# EasyEDA Pro project hydroNodeStation01PCB.epro

# Board PCB2
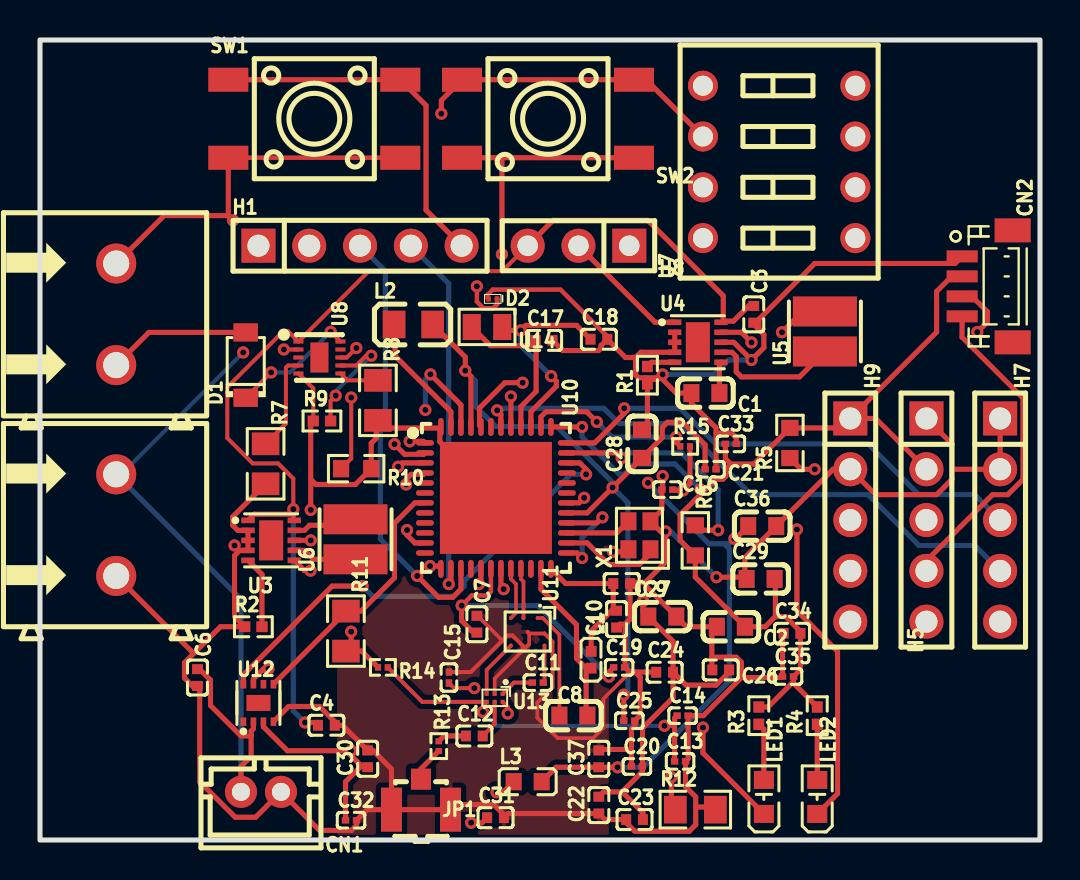
[diagram p0: board, top side]
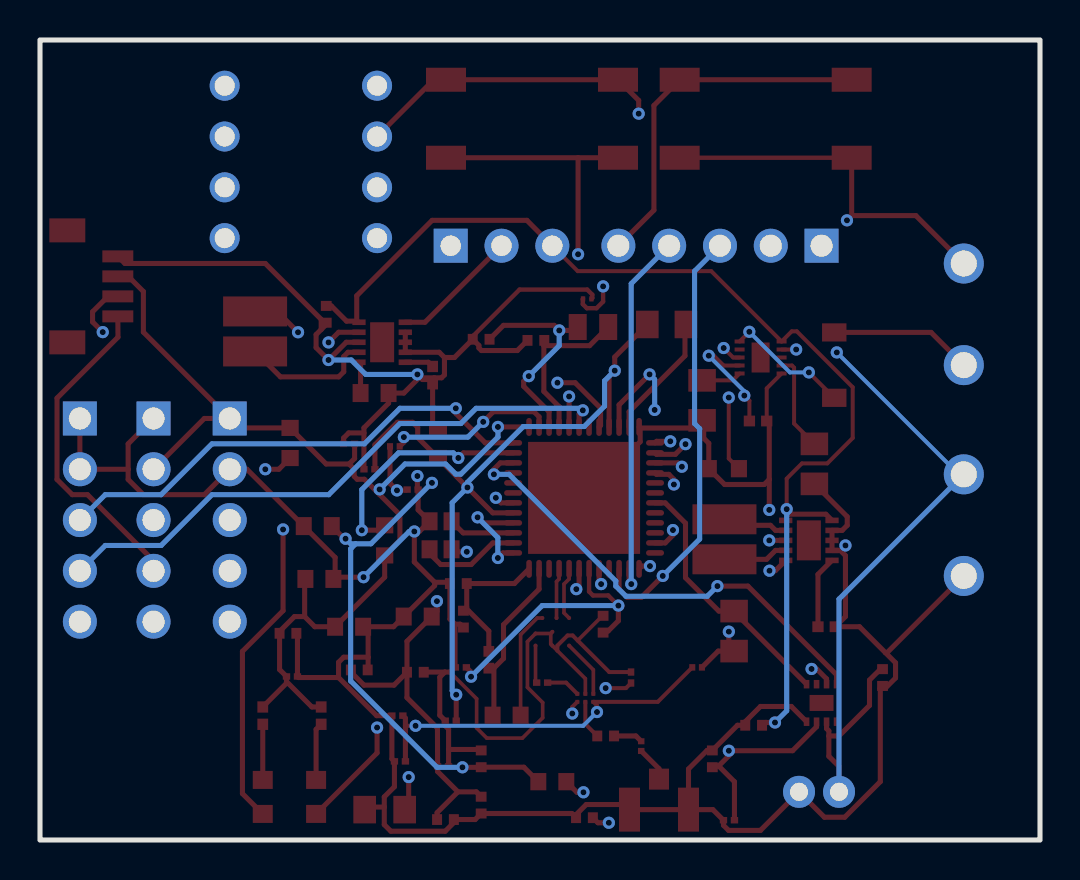
[diagram p1: board, bottom side, seen from below]

Outline 50 x 40 mm; copper layers: Top Layer, Inner1, Inner2, Bottom Layer. Coordinates in mm from the lower left corner of the outline.
Outline path: rectangle 0,40 50,0
Stack: Top Layer 0.035mm Outer layer thickness 1oz / Dielectric1 0.2104mm 7628 RC49% 8.6mil / Inner1 0.0152mm Inner layer thickness / Dielectric2 1.065mm 1.1mm H/HOZ Copper / Inner2 0.0152mm Inner layer thickness / Dielectric3 0.2104mm 7628 RC49% 8.6mil / Bottom Layer 0.035mm Outer layer thickness 1oz

## Design rules (mm)
template: JLCPCB Capability(Two Layers Board)
spacing copperThickness1oz (default): track to track 0.102, other pairs 0.152 to 0.3
spacing copperThickness2oz: track to track 0.203, other pairs 0.152 to 0.3
track width copperThickness1oz (default): min 0.127, default 0.254, max 2.54
track width copperThickness2oz: min 0.203, default 0.254, max 2.54
differential pair differentialPair (default): width min 0.127, default 0.254, max 2.54; gap min 0.152, default 0.152
via viaSize (default): diameter min 0.5, default 0.61, max 10; hole min 0.3, default 0.305, max 6.3

## Placement (name value [footprint] x y rotation side)
C1  22uF  [C0603]  33.27 22.35 180 top
C2  22uF  [C0603]  34.54 10.66 180 top
C3  10uF  [C0402]  35.69 26.28 270 top
C4  10uF  [C0402]  14.32 5.74 0 top
C6  100nF  [C0402]  7.87 8.12 270 top
C7  100nF  [C0402]  21.84 10.79 270 top
C8  100pF  [C0603]  26.67 6.22 0 top
C9  68pF  [C0402]  29.08 12.82 180 top
C10  47nF  [C0402]  28.83 11.04 90 top
C11  68pF  [C0201]  24.89 7.87 0 top
C12  68pF  [C0402]  21.72 5.2 0 top
C13  100nF  [C0201]  32 3.93 0 top
C14  1nF  [C0201]  32.13 6.22 0 top
C15  100nF  [C0201]  20.45 8.12 270 top
C16  1nF  [C0201]  31.37 17.52 0 top
C17  6.8pF  [C0402]  25.21 24.98 0 top
C18  6.8pF  [C0402]  27.94 25.04 0 top
C19  100nF  [C0201]  28.96 8.63 0 top
C20  33pF  [C0201]  29.84 3.68 0 top
C21  33pF  [C0201]  33.53 18.54 180 top
C22  100nF  [C0402]  27.94 1.74 90 top
C23  100nF  [C0402]  29.73 1.02 0 top
C24  100nF  [C0402]  31.23 8.39 0 top
C25  33pF  [C0201]  29.46 5.96 0 top
C26  100nF  [C0402]  34.04 8.5 180 top
C27  4.7uF  [C0603]  31.12 11.17 0 top
C28  470nF  [C0603]  30.1 19.81 90 top
C29  4.7uF  [C0603]  36.03 13.05 0 top
C30  100nF  [C0402]  16.38 4.06 90 top
C31  100nF  [C0402]  22.78 1.12 0 top
C32  100nF  [C0201]  15.55 0.99 0 top
C33  100nF  [C0201]  34.54 19.81 0 top
C34  100nF  [C0402]  37.6 10.33 0 top
C35  100nF  [C0201]  37.4 8.18 0 top
C36  4.7uF  [C0603]  36.11 15.69 0 top
C37  100nF  [C0402]  27.94 4.06 90 top
CN1  B2B-PH-K-S(LF)(SN)  [CONN-TH_B2B-PH-K-S]  11.05 2.41 180 top
CN2  BM04B-SRSS-TB(LF)(SN)  [CONN-SMD_BM04B-SRSS-TB]  47.37 27.68 270 top
D1  MBRX120LF-TP  [SOD-123_L2.7-W1.6-LS3.7-RD]  10.29 23.74 90 top
D2  ESDALC6V1-1U2  [DFN0603-D_L0.6-W0.3-P0.34-RD]  22.64 27.06 180 top
H1  PZ254V-11-05P  [HDR-TH_5P-P2.54-V-M]  16 29.71 0 top
H5  PZ254V-11-05P  [HDR-TH_5P-P2.54-V-M]  44.32 16 270 top
H7  PZ254V-11-05P  [HDR-TH_5P-P2.54-V-M]  48.01 16 270 top
H8  PZ254V-11-03P  [HDR-TH_3P-P2.54-V-M_PZ254V-11-03P]  26.92 29.71 180 top
H9  PZ254V-11-05P  [HDR-TH_5P-P2.54-V-M]  40.51 16 270 top
JP1  6GHz  [RF-SMD_FRF05002-JSS103M]  19.05 2.28 180 top
L1  47nH  [L0402]  27.56 9.01 270 top
L2  15uH  [L0805]  18.67 25.78 0 top
L3  FCM1608KF-601T03  [L0603]  24.38 2.92 0 top
LED1  YLED0603R  [LED0603-FD]  36.19 2.15 270 top
LED2  YLED0603R  [LED0603-FD]  38.86 2.15 270 top
P1  WJ500V-5.08-2P  [CONN-TH_2P-P5.00_WJ500V-5.08-2P]  3.81 26.28 90 top
P2  WJ500V-5.08-2P  [CONN-TH_2P-P5.00_WJ500V-5.08-2P]  3.81 15.74 90 top
R1  36.5kΩ  [R0402]  30.37 23.24 90 top
R2  16.2kΩ  [R0402]  10.67 10.66 0 top
R3  1kΩ  [R0402]  35.94 6.22 90 top
R4  1kΩ  [R0402]  38.86 6.22 90 top
R5  4.7kΩ  [R0603]  37.5 19.85 90 top
R6  4.7kΩ  [R0603]  32.77 14.98 270 top
R7  10kΩ  [R0805]  11.28 18.81 270 top
R8  10kΩ  [R0805]  16.9 21.98 270 top
R9  12kΩ  [R0402]  14.1 20.95 0 top
R10  300Ω  [R0603]  15.81 18.57 180 top
R11  10kΩ  [R0805]  15.29 10.45 270 top
R12  10kΩ  [R0805]  32.77 1.52 0 top
R13  0Ω  [R0201]  19.94 4.69 270 top
R14  100Ω  [R0201]  17.15 8.63 180 top
R15  100Ω  [R0201]  32.26 19.68 0 top
SW1  TS-1095PS-A1B2-C3D2  [KEY-SMD_4P-L6.0-W6.0-P3.90-LS9.0]  13.72 36.06 0 top
SW2  TS-1095PS-A1B2-C3D2  [KEY-SMD_4P-L6.0-W6.0-P3.90-LS9.0]  25.4 36.06 180 top
U3  TPS63900DSKR  [WSON-10_L2.5-W2.5-W0.50-TL-EP]  11.56 14.98 0 top
U4  TPS63900DSKR  [WSON-10_L2.5-W2.5-W0.50-TL-EP]  32.89 24.89 0 top
U5  2.2uH  [IND-SMD_L3.0-W3.0_LVF303012-4R7M-N]  39.25 25.43 90 top
U6  2.2uH  [IND-SMD_L3.0-W3.0_LVF303012-4R7M-N]  15.78 15.03 90 top
U7  SMQS-04R-TP  [SW-TH_8P-P2.54_SMQS-04R-TP]  36.96 33.9 90 top
U8  BQ25185DLHR  [WSON-10_L2.2-W2.0-P0.40-BL-EP_TI_DLH0010A]  13.97 24.12 270 top
U10  STM32WLE5CCU6  [UFQFPN-48_L7.0-W7.0-P0.50-BL-EP5.6]  22.8 17.1 270 top
U11  BALFHB-WL-02D3  [CSPG-8_L2.1-W1.8_BALFHB-WL-03D3]  24.38 10.41 270 top
U12  MAX17048G+T10  [TDFN-8_L2.0-W2.0-P0.50-BL-EP1.2]  10.92 6.85 0 top
U13  BGS12SN6E6327XTSA1  [TSNP-6_L1.1-W0.7-P0.40-BL]  22.73 7.11 180 top
U14  32.768kHz  [CRYSTAL-SMD_L2.0-W1.2]  22.35 25.65 180 top
X1  32MHz  [CRYSTAL-SMD_4P-L2.0-W1.6-BL]  29.97 15.23 90 top

## Footprints (pads in the part's own frame, mm; a bottom-side part is the same pattern mirrored in y, then rotated)
C0201
  rect 0.368x0.324 smd: 1(-0.275,0) 2(0.275,0)
C0402
  rect 0.5x0.54 smd: 1(-0.42,0) 2(0.42,0)
C0603
  rect 0.8x0.9 smd: 1(-0.7,0) 2(0.7,0)
CONN-SMD_BM04B-SRSS-TB
  rect 1.2x1.8 smd: 0(-2.8,1.262) 0(2.8,1.262)
  rect 0.6x1.55 smd: 1(-1.5,-1.262) 2(-0.5,-1.262) 3(0.5,-1.262) 4(1.5,-1.262)
CONN-TH_2P-P5.00_WJ500V-5.08-2P
  round 2 hole 1.3: 1(-2.54,0) 2(2.54,0)
CONN-TH_B2B-PH-K-S
  round 1.6 hole 0.9: 1(1,0) 2(-1,0)
CRYSTAL-SMD_4P-L2.0-W1.6-BL
  rect 0.9x0.8 smd: 1(-0.7,-0.55) 2(0.7,-0.55) 3(0.7,0.55) 4(-0.7,0.55)
CRYSTAL-SMD_L2.0-W1.2
  rect 0.9x1.3 smd: 1(-0.762,0) 2(0.762,0)
CSPG-8_L2.1-W1.8_BALFHB-WL-03D3
  round 0.204 smd: A1(-0.69,0.5) A2(-0.69,-0.21) A3(-0.69,-0.84) B1(0.085,0.84) B2(0,0) C1(0.69,0.84) C2(0.69,0) C3(0.69,-0.84)
DFN0603-D_L0.6-W0.3-P0.34-RD
  rect 0.22x0.26 smd: 1(-0.21,0) 2(0.21,0)
HDR-TH_3P-P2.54-V-M_PZ254V-11-03P
  rect 1.7x1.7 hole 1.02: 1(-2.54,0)
  round 1.7 hole 1.02: 2(0,0) 3(2.54,0)
HDR-TH_5P-P2.54-V-M
  rect 1.7x1.7 hole 1.1: 1(-5.08,0)
  round 1.7 hole 1.1: 2(-2.54,0) 3(0,0) 4(2.54,0) 5(5.08,0)
IND-SMD_L3.0-W3.0_LVF303012-4R7M-N
  rect 1.5x3.2 smd: 1(-1,0) 2(1,0)
KEY-SMD_4P-L6.0-W6.0-P3.90-LS9.0
  rect 2x1.2 smd: 1(-4.3,1.95) 2(4.3,1.95) 3(-4.3,-1.95) 4(4.3,-1.95)
L0402
  rect 0.54x0.54 smd: 1(-0.42,0) 2(0.42,0)
L0603
  rect 0.8x0.864 smd: 1(-0.7,0) 2(0.7,0)
L0805
  rect 1.133x1.377 smd: 1(-0.966,0) 2(0.966,0)
LED0603-FD
  rect 0.9x1 smd: 1(-0.85,0) 2(0.85,0)
R0201
  rect 0.303x0.324 smd: 1(-0.241,0) 2(0.241,0)
R0402
  rect 0.566x0.54 smd: 1(-0.433,0) 2(0.433,0)
R0603
  rect 0.806x0.864 smd: 1(-0.753,0) 2(0.753,0)
R0805
  rect 1.133x1.377 smd: 1(-1,0) 2(1,0)
RF-SMD_FRF05002-JSS103M
  rect 1x1.05 smd: 1(0,-0.762)
  rect 1.05x2.2 smd: 2(-1.475,0.762) 3(1.475,0.762)
SOD-123_L2.7-W1.6-LS3.7-RD
  rect 0.91x1.22 smd: 1(-1.635,0) 2(1.635,0)
SW-TH_8P-P2.54_SMQS-04R-TP
  round 1.5 hole 1: 1(-3.81,-3.81) 2(-1.27,-3.81) 3(1.27,-3.81) 4(3.81,-3.81) 5(3.81,3.81) 6(1.27,3.81) 7(-1.27,3.81) 8(-3.81,3.81)
TDFN-8_L2.0-W2.0-P0.50-BL-EP1.2
  rect 0.28x0.425 smd: 1(-0.75,-0.938) 2(-0.25,-0.938) 3(0.25,-0.938) 4(0.75,-0.938) 5(0.75,0.938) 6(0.25,0.938) 7(-0.25,0.938) 8(-0.75,0.938)
  rect 1.2x0.8 smd: 9(0,0)
TSNP-6_L1.1-W0.7-P0.40-BL
  rect 0.2x0.2 smd: 1(-0.4,-0.2) 2(0,-0.2) 3(0.4,-0.2) 4(0.4,0.2) 5(0,0.2) 6(-0.4,0.2)
UFQFPN-48_L7.0-W7.0-P0.50-BL-EP5.6
  oval 0.28x0.9 smd: 1(-2.751,-3.547) 2(-2.251,-3.547) 3(-1.75,-3.547) 4(-1.25,-3.547) 5(-0.75,-3.547) 6(-0.249,-3.547) 7(0.249,-3.547) 8(0.75,-3.547) 9(1.25,-3.547) 10(1.75,-3.547) 11(2.251,-3.547) 12(2.751,-3.547) 25(2.751,3.547) 26(2.251,3.547) 27(1.75,3.547) 28(1.25,3.547) 29(0.75,3.547) 30(0.249,3.547) 31(-0.249,3.547) 32(-0.75,3.547) 33(-1.25,3.547) 34(-1.75,3.547) 35(-2.251,3.547) 36(-2.751,3.547)
  oval 0.9x0.28 smd: 13(3.547,-2.75) 14(3.547,-2.25) 15(3.547,-1.75) 16(3.547,-1.25) 17(3.547,-0.75) 18(3.547,-0.25) 19(3.547,0.25) 20(3.547,0.75) 21(3.547,1.25) 22(3.547,1.75) 23(3.547,2.25) 24(3.547,2.75) 37(-3.547,2.751) 38(-3.547,2.251) 39(-3.547,1.75) 40(-3.547,1.25) 41(-3.547,0.75) 42(-3.547,0.249) 43(-3.547,-0.249) 44(-3.547,-0.75) 45(-3.547,-1.25) 46(-3.547,-1.75) 47(-3.547,-2.251) 48(-3.547,-2.751)
  rect 5.6x5.6 smd: 49(0,0)
WSON-10_L2.2-W2.0-P0.40-BL-EP_TI_DLH0010A
  rect 0.2x0.5 smd: 1(-0.8,-1.05) 2(-0.4,-1.05) 3(0,-1.05) 4(0.4,-1.05) 5(0.8,-1.05) 6(0.8,1.05) 7(0.4,1.05) 8(0,1.05) 9(-0.4,1.05) 10(-0.8,1.05)
  rect 1.5x0.9 smd: 11(0,0)
WSON-10_L2.5-W2.5-W0.50-TL-EP
  rect 0.665x0.28 smd: 1(-1.157,1) 2(-1.157,0.5) 3(-1.157,0) 4(-1.157,-0.5) 5(-1.157,-1) 6(1.157,-1) 7(1.157,-0.5) 8(1.157,0) 9(1.157,0.5) 10(1.157,1)
  rect 1.2x2 smd: 11(0,0)

## Nets
+5V: C1.1 U4.6
GND: C1.2 C2.2 C3.2 C4.2 C6.2 C7.1 C9.1 C10.1 C13.2 C14.2 C15.1 C16.1 C17.2 C18.2 C19.2 C20.1 C21.1 C22.1 C23.1 C24.1 C25.2 C26.2 C27.2 C28.2 C29.1 C30.2 C31.2 C32.2 C33.2 C34.1 C35.1 C36.2 C37.2 CN1.2 CN2.1 D2.2 H1.1 H5.1 H7.1 H7.2 H9.2 JP1.2 JP1.3 P1.2 P2.1 R1.1 R2.1 R7.2 R8.2 R9.1 R10.1 R12.2 SW1.3 SW1.4 U3.2 U3.3 U3.4 U3.8 U4.2 U4.3 U4.4 U4.8 U8.5 U10.48 U10.49 U11.B1 U11.B2 U11.C2 U12.4 U13.2 X1.2 X1.4
VCC: C2.1 C29.2 C30.1 C31.1 C32.1 C33.1 C34.2 C35.2 CN2.2 H1.2 H5.2 H9.1 L3.1 R3.2 R4.2 R5.2 R6.2 R11.2 R14.2 SW2.3 SW2.4 U3.6 U7.6 U10.11 U10.37 U10.44 U12.3
VDDA: C36.1 C37.1 L3.2 U10.41
VDDPA: C20.2 C22.2 C23.2 C24.2 C26.1 C27.1 U10.25 U10.28 U10.46
VDDRF1V55: C21.2 C25.1 C28.1 L2.2 U10.29 U10.45
BOOT: R12.1 SW2.1 SW2.2 U10.19
CLK: H7.4 U10.42
DIO: H7.3 U10.36
EN5V: H8.1 U10.17
LED1: LED1.2 U7.8
LED2: LED2.2 U7.7
LIPOPLUS: C3.1 C4.1 H8.3 U3.1 U3.10 U4.10 U8.1
PA0: R11.1 U10.7 U12.5
PB0: H9.3 U10.30
PB3: U7.2 U10.1
PB4: U7.3 U10.2 U10.13
PB5: U7.1 U10.3
PB6: H5.5 U10.4
PC13: R15.1 U10.38
RST: C7.2 C19.1 D2.1 H1.5 H7.5 SW1.1 SW1.2 U10.18
RX: H1.3 U10.15
SCL: CN2.4 H5.4 R6.1 U10.35 U12.7
SDA: CN2.3 H5.3 R5.1 U10.34 U12.8
TX: H1.4 U10.14
$1N2497: U3.7 U6.1
$1N2498: U3.9 U6.2
$1N2499: U4.9 U5.2
$1N2500: U4.7 U5.1
$1N2509: R2.2 U3.5
$1N2510: R1.2 U4.5
$1N2511: H8.2 U4.1
$1N2534: LED1.1 R3.1
$1N2535: LED2.1 R4.1
$1N2561: C6.1 CN1.1 P2.2 U8.2 U12.2
$1N2563: R7.1 U8.4
$1N2564: D1.1 U8.10
$1N2565: D1.2 P1.1
$1N2566: R8.1 U8.6
$1N2567: R9.2 U8.7
$1N2569: R10.2 U8.8
$1N5916: U10.21 U11.A2
$1N5921: U10.20 U11.A3
$1N5997: C8.1 U11.A1
$1N6001: C8.2 L1.2 U10.23
$1N6167: C9.2 C10.2 L1.1 U10.24
$1N6399: C11.2 U11.C1
$1N6407: C11.1 U13.1
$1N6414: U11.C3 U13.3
$1N6545: C12.2 U13.5
$1N6584: C12.1 R13.1
$1N6623: JP1.1 R13.2
$1N6744: C13.1 C14.1 R14.1 U13.4
$1N7058: C15.2 C16.2 R15.2 U13.6
$1N7436: U10.27 X1.3
$1N7448: U10.26 X1.1
$1N7626: C17.1 U10.40 U14.2
$1N7632: C18.1 U10.39 U14.1
$1N11363: L2.1 U10.47

Pads without a net: CN2 0; H9 4 5; U3 11; U4 11; U7 4 5; U8 3 9 11; U10 5 6 8 9 10 12 16 22 31 32 33 43; U12 1 6 9

## Via types
v1: diameter 0.61, hole 0.305, Top Layer to Bottom Layer, 79 vias

## Routing (per net, layer and track width the routed paths; a pad name or vN(x,y) marks a point on that pad's centre or on a via; arc(x,y) is an arc through that point)
+5V: length 1.6
  Top Layer w0.254: U4.6 33.97,23.81 C1.1
GND: length 279.1
  Top Layer w0.184: U13.2 22.73,8.07 U11.C2 24.46,9.8 24.46,10.32 ; 29.5,8.4 28.17,7.06 28.17,5.6 27.66,5.09 25.88,5.09 24.87,6.11 24.87,6.87 25.63,7.63 25.63,9.92 U11.B1 24.46,10.32 ; 23.11,9.97 21.88,11.21 C7.1 ; 24.46,10.32 U11.B2
  Top Layer w0.2: 24.13,9.46 24.13,9.72 23.62,10.23 23.37,10.23 21.54,8.4 C15.1 ; U8.5 13.66,22.58 13.66,20.95
  Top Layer w0.22: D2.2 22.38,27.1 22.38,27.27 22.64,27.52 26.02,27.52 28.31,25.23 28.31,24.98 ; SW1.3 18.02,34.11
  Top Layer w0.254: 7.73,9.37 9.02,10.66 R2.1 9.73,11.17 9.73,14.22 9.98,14.47 ; 7.73,9.37 7.64,9.37 P2.1 ; 7.73,9.37 7.22,8.86 7.22,8.1 7.73,7.59 7.99,7.59 ; U10.49 19.99,19.91 19.99,20.6 ; C28.2 30.37,20.78 R1.1 30.37,23.02 ; 7.99,7.59 C6.2 ; 7.99,7.59 7.99,2.92 9.76,1.14 10.78,1.14 CN1.2 13.98,0.48 15.57,0.48 15.83,0.73 C32.2 16.36,1.52 JP1.3 ; CN2.1 45.75,28.83 38.74,28.83 35.94,26.03 35.94,25.52 ; C26.2 33.59,8.53 33.59,9.14 ; 30.27,12.89 30.27,12.72 C27.2 32.32,10.66 33.59,10.66 ; 30.27,12.89 29.57,12.89 C9.1 29.5,11.04 29.25,10.79 ; 30.27,12.89 31.28,13.9 v1(31.28,15.43) 31.03,15.43 X1.2 31.09,16.51 C16.1 31.13,17.56 v1(31.13,18.2) ; 45.59,18.54 48.01,18.54 H7.1 ; 45.59,18.54 45.59,18.03 44.83,17.27 41.78,17.27 40.51,18.54 39.65,18.54 C36.2 35.24,14.13 35.24,13.14 ; 45.59,18.54 45.59,19.81 H5.1 ; R8.2 16.81,20.9 16.81,20.6 ; 19.99,20.6 U10.48 ; 19.99,20.6 16.81,20.6 ; 33.59,10.66 33.59,9.14 ; 33.59,10.66 33.84,10.66 ; 33.59,9.14 34.82,9.14 35.07,8.88 35.07,8.12 ; 33.8,20.35 34.56,20.35 34.82,20.1 C33.2 ; 33.8,20.35 C21.1 ; 33.8,20.35 33.8,20.61 32.57,21.84 C1.2 31.81,22.35 31.05,23.11 30.96,23.11 ; 30.28,23.11 29.92,23.11 29.78,23.26 29.78,24.12 ; 30.28,23.11 30.37,23.02 ; 30.28,23.11 30.96,23.11 ; 16.81,20.6 16.81,20.09 16.56,19.84 R10.1 15.77,17.77 13.79,17.77 13.54,18.03 ; JP1.3 17.57,3.55 16.65,4.48 C30.2 15.13,5.74 C4.2 14.74,5.92 13.98,6.68 12.43,6.68 U12.4 ; JP1.3 JP1.2 20.78,1.77 22.69,1.77 23.2,1.26 C31.2 23.41,1.32 C22.1 28.24,1.02 C23.1 29.31,0.87 29.74,0.44 32.46,0.44 32.79,0.77 32.79,1.65 ; 29.25,10.79 29.25,8.65 ; 29.25,10.79 29,10.79 C10.1 ; v1(33.82,13.14) 35.24,13.14 ; 35.24,13.14 C29.1 ; 30.37,23.02 30.88,23.02 30.96,23.11 ; 29.57,4.53 C20.1 ; 29.57,4.53 27.99,4.53 C37.2 ; 29.57,4.53 29.57,5.54 29.74,5.71 C25.2 30.01,6.24 30.01,8.14 29.76,8.4 ; 32.79,1.65 33.64,1.65 R12.2 ; 32.79,1.65 32.79,2.15 32.28,2.66 C13.2 32.41,4.06 C14.2 33.17,6.22 35.07,8.12 ; C24.1 30.8,8.4 29.76,8.4 ; 35.07,8.12 37.07,8.12 C35.1 37.13,10.28 C34.1 ; 30.96,23.11 v1(31.13,23.28) ; 9.98,14.47 10.39,14.47 U3.4 U3.3 U3.2 9.89,15.48 9.64,15.73 9.64,16.16 R7.2 ; 9.98,14.47 v1(9.73,14.73) ; v1(9.65,30.98) 9.42,31.22 ; 9.42,31.22 SW1.3 ; 9.42,31.22 6.2,31.22 P1.2 ; 29.25,8.65 C19.2 ; 29.25,8.65 29.5,8.4 29.76,8.4 ; U4.2 U4.3 U4.4 30.04,24.39 29.78,24.12 ; 35.94,25.52 35.69,25.78 C3.2 ; 35.94,25.52 36.19,25.27 36.19,24.62 v1(35.57,24) 34.69,24.89 U4.8 ; 13.54,18.03 13.54,20.82 13.66,20.95 ; 13.54,18.03 v1(13.54,16.5) ; 29.78,24.12 29.27,24.12 C18.2 28.05,24.73 28.05,24.6 27.93,24.47 26.13,24.47 25.63,24.98 ; v1(28.66,14.41) 29.3,14.41 X1.4 ; v1(13.54,14.98) U3.8
  Inner1 w0.2: v1(13.54,16.5) 13.54,27.1 H1.1
  Inner1 w0.254: v1(31.28,15.43) 29.68,15.43 v1(28.66,14.41) ; v1(13.54,14.98) 12.52,14.98 12.27,14.73 v1(9.73,14.73) ; H1.1 v1(9.65,30.98)
  Inner2 w0.254: v1(13.54,14.98) v1(13.54,16.5) ; v1(31.13,23.28) v1(31.13,18.2)
  Bottom Layer w0.254: v1(31.28,15.43) 31.54,15.43 v1(33.82,13.14) ; v1(35.57,24) 34.43,24 33.71,23.28 v1(31.13,23.28)
VCC: length 164.2
  Top Layer w0.254: 37.68,7.92 36.41,6.65 R3.2 ; 37.68,7.92 C35.2 38.02,8.52 C34.2 38.02,10.43 37.28,11.17 36.77,11.17 ; 37.68,7.92 37.68,7.84 R4.2 ; v1(22.83,2.39) 23.15,2.39 L3.1 ; v1(13.53,13.47) 13.23,13.47 U3.6 ; v1(21.56,0.86) 22.1,0.86 C31.1 ; CN2.2 45.59,28.18 44.83,27.43 44.83,25.39 H9.1 ; 16.07,3.7 15.28,2.91 C32.1 ; 16.07,3.7 16.32,3.7 C30.1 ; 16.07,3.7 15.56,4.21 v1(15.56,4.46) 12.37,4.46 11.17,5.66 U12.3 ; U10.11 18.74,14.85 18.35,15.24 v1(18.35,15.5) ; 34.54,18.8 34.29,18.55 34.29,18.18 34.14,18.04 33.78,18.04 33.02,17.28 ; 34.54,18.8 34.27,19.07 C33.1 ; 34.54,18.8 35.69,18.8 R5.2 40.04,20.6 H9.1 ; 36.77,11.17 36.26,10.66 C2.1 32.77,13.14 R6.2 32,14.99 32,16.26 33.02,17.28 ; 36.77,11.17 36.77,13.02 C29.2 ; 44.32,18.54 41.78,21.08 H9.1 ; 33.02,17.28 v1(33.02,17.53) ; v1(15.56,10.42) 15.56,9.71 R11.2 16.09,9.45 R14.2 ; U10.44 21.97,20.73 21.97,21.59 23.24,22.86 v1(24.13,22.86) ; U7.6 30.31,38.01 21.1,38.01 20.07,36.98 v1(20.07,36.32) ; v1(27.1,20.65) U10.37
  Inner1 w0.254: 16.32,5.34 15.56,4.58 v1(15.56,4.46) ; 16.32,5.34 16.32,5.85 15.56,6.61 v1(15.56,10.42) ; 16.32,5.34 17.08,5.34 v1(21.56,0.86) 21.56,1.12 v1(22.83,2.39) ; v1(20.07,36.32) H1.2 13.46,28.45 19.3,22.61 ; v1(18.35,15.5) 18.35,15.75 16.51,17.59 16.51,20.32 18.8,22.61 19.3,22.61 ; 19.3,22.61 20.57,22.61 20.83,22.86 v1(24.13,22.86)
  Inner2 w0.254: v1(33.02,17.53) 33.02,22.36 31.5,23.88 27.94,23.88 26.42,22.36 24.64,22.36 v1(24.13,22.86) ; v1(13.53,13.47) 14.03,13.97 15.3,13.97 ; v1(15.56,10.42) 15.3,10.67 15.3,13.97 ; 15.3,13.97 15.56,13.97 17.08,15.5 v1(18.35,15.5)
  Bottom Layer w0.254: v1(27.1,20.65) 27.1,20.14 28.96,18.29 29.21,18.29 29.72,18.8 31.75,18.8 v1(33.02,17.53)
VDDA: length 35.7
  Top Layer w0.254: C37.1 25.81,3.64 L3.2 ; C36.1 34.78,15.06 v1(34.72,15.06) ; U10.41 v1(23.55,22.18) ; v1(28.88,3.63) 27.94,3.63
  Inner2 w0.254: v1(30.4,17.86) 30.4,18.62 29.13,19.89 25.83,19.89 v1(23.55,22.18)
  Bottom Layer w0.254: 34.21,14.81 34.47,14.81 v1(34.72,15.06) ; 34.21,14.81 34.47,14.56 34.47,7.95 30.15,3.63 v1(28.88,3.63) ; 34.21,14.81 33.45,14.81 v1(30.4,17.86)
VDDPA: length 48.6
  Top Layer w0.254: U10.28 27.84,15.86 v1(28.12,16.13) ; 29.1,2.41 30.15,1.36 C23.2 ; 29.1,2.41 28.18,2.41 C22.2 ; 29.1,2.41 30.12,3.42 C20.2 30.13,5.59 31.65,7.12 C24.2 ; v1(19.52,23.28) 21.05,21.76 U10.46 ; v1(27.11,14.1) 26.85,14.35 U10.25 ; C26.1 34.46,8.4 33.8,7.74 32.3,7.74 C24.2 ; C24.2 31.65,9.93 C27.1 30.15,11.43 v1(30.15,11.94)
  Inner1 w0.254: v1(30.15,11.94) 27.99,14.1 v1(27.11,14.1) 21.08,14.1 16.98,18.2 16.98,19.98 18,20.99 18.76,20.99 v1(19.27,21.5)
  Bottom Layer w0.254: v1(19.52,23.28) 19.27,23.03 v1(19.27,21.5) ; v1(27.11,14.1) 27.11,15.12 v1(28.12,16.13)
VDDRF1V55: length 39.4
  Top Layer w0.254: v1(29.19,7.26) C25.1 ; C21.2 33.25,19.76 32.13,20.88 31.37,20.88 31.12,20.63 31.12,20.12 C28.1 30.1,19.1 v1(28.63,17.63) 27.36,16.36 U10.29 ; U10.45 21.55,23.19 v1(21.26,23.47) 21.26,24.15 L2.2
  Bottom Layer w0.254: v1(29.19,7.26) 29.39,7.47 29.39,16.86 v1(28.63,17.63) 28.63,17.88 25.84,20.67 22.79,20.67 21.77,21.69 21.77,22.96 v1(21.26,23.47)
BOOT: length 49.1
  Top Layer w0.254: 23.1,34.11 v1(23.1,29.29) ; 23.1,34.11 29.7,34.11 ; 23.1,34.11 SW2.2 ; v1(23.18,12.54) 23.05,12.68 U10.19 ; v1(31.57,3.14) 31.57,1.72 R12.1
  Inner1 w0.254: v1(31.57,3.14) 23.18,11.53 v1(23.18,12.54)
  Inner2 w0.254: v1(23.1,29.29) 23.1,24.46 21.15,22.52 21.15,12.54 21.66,12.03 22.17,12.03 22.68,12.54 v1(23.18,12.54)
CLK: length 29.5
  Top Layer w0.254: U10.42 23.04,21.3 v1(22.86,21.48)
  Bottom Layer w0.254: v1(22.86,21.48) 22.96,21.58 28.19,21.58 28.96,20.82 32,20.82 35.56,17.27 41.4,17.27 43.94,14.73 46.74,14.73 H7.4
DIO: length 24.8
  Top Layer w0.254: U10.36 27.74,19.86 29.21,21.33 v1(29.21,21.58)
  Bottom Layer w0.254: H7.3 46.74,17.27 43.94,17.27 41.4,19.81 33.78,19.81 32,21.58 v1(29.21,21.58)
EN5V: length 20.8
  Top Layer w0.254: U10.17 22.05,12.9 v1(21.94,12.8)
  Inner2 w0.254: H8.1 21.94,22.19 v1(21.94,12.8)
LED1: length 30.5
  Top Layer w0.254: v1(33.15,5.62) 33.15,4.35 LED1.2
  Inner2 w0.254: v1(33.15,5.62) 33.15,16.8 33.66,17.31 33.66,29.59 U7.8
LED2: length 34.5
  Top Layer w0.254: v1(37.85,15.53) 37.85,11.46 39.88,9.43 39.88,2.32 LED2.2
  Inner2 w0.254: v1(37.85,15.53) 37.85,27.94 U7.7
LIPOPLUS: length 56.3
  Top Layer w0.2: 24.38,29.71 23.11,28.44 16.44,28.44 U8.1 12.41,25.43 12.16,25.43 9.36,22.64 9.36,20.1 10.63,18.83 11.9,18.83 12.67,18.07 v1(12.67,16.54) 12.67,16.03 U3.10
  Top Layer w0.254: 34.16,25.94 U4.10 ; 34.16,25.94 34.16,27.21 30.39,30.98 25.65,30.98 24.38,29.71 ; 34.16,25.94 34.67,25.94 35.43,26.7 C3.1 ; 12.67,16.29 10.71,16.29 U3.1 ; v1(13.25,5.88) 13.76,5.88 C4.1
  Bottom Layer w0.254: v1(12.67,16.54) 12.67,6.46 v1(13.25,5.88)
PA0: length 12.9
  Top Layer w0.254: U12.5 15.29,11.41 R11.1 16.06,11.45 17.72,13.11 17.72,15.84 18.74,16.86 U10.7
PB0: length 14.7
  Top Layer w0.254: v1(27.21,17.11) 26.95,16.86 U10.30
  Inner1 w0.254: v1(27.21,17.11) 27.56,16.76 39.75,16.76 H9.3
PB3: length 29.1
  Top Layer w0.254: v1(18.49,19.93) 19.17,19.93 U10.1
  Inner1 w0.254: v1(18.49,19.93) 27.81,19.93 28.57,20.7 28.57,21.97 39.24,32.63 U7.2
PB4: length 38.8
  Top Layer w0.254: U10.2 19.18,19.28 18.23,19.28 v1(17.72,19.79) ; U10.13 19.91,13.7 v1(19.5,13.7)
  Inner1 w0.254: v1(17.72,19.79) 17.72,20.05 18.23,20.55 26.15,20.55 U7.3
  Inner2 w0.254: v1(19.5,13.7) 19.5,18.01 v1(17.72,19.79)
PB5: length 29
  Top Layer w0.254: v1(17.91,18.66) 18.1,18.85 U10.3
  Inner1 w0.254: v1(17.91,18.66) 18.16,18.92 28.07,18.92 39.24,30.09 U7.1
PB6: length 31.1
  Top Layer w0.254: v1(18.3,17.77) 18.3,18.03 18.56,18.28 19.18,18.28 19.25,18.35
  Inner1 w0.254: v1(18.3,17.77) 20.59,15.49 28.32,15.49 29.08,16.25 34.67,16.25 36.19,14.73 41.02,14.73 44.32,11.42 H5.5
PC13: length 8.5
  Top Layer w0.254: v1(31.81,20.14) 31.81,19.89 R15.1 ; U10.38 25.05,21.16 25.3,21.41 27.33,21.41 v1(27.84,20.91)
  Bottom Layer w0.254: v1(31.81,20.14) 28.6,20.14 v1(27.84,20.91)
RST: length 75.2
  Top Layer w0.22: U10.18 22.55,12.42 22.35,12.23 21.59,12.23 v1(21.08,11.72) ; v1(21.84,27.68) 21.84,26.92 22.17,26.59 22.66,26.59 22.86,26.79 22.86,27.04 D2.1
  Top Layer w0.254: v1(28.45,8.16) 28.45,8.4 C19.1 ; v1(21.08,11.72) 21.08,10.96 21.59,10.45 21.76,10.45 C7.2 ; H1.5 19.3,31.49 19.3,36.72 18.02,38.01 9.42,38.01
  Inner1 w0.254: v1(28.45,8.16) 45.25,8.16 H7.5
  Inner2 w0.22: v1(21.08,11.72) 20.57,12.23 20.07,12.23 19.81,12.48 19.81,12.99 20.57,13.75 20.57,26.41 v1(21.84,27.68) 21.84,28.95 H1.5
  Bottom Layer w0.254: v1(21.08,11.72) 24.89,11.72 v1(28.45,8.16)
RX: length 21.7
  Top Layer w0.254: U10.15 21.05,12.54 20.64,12.13 19.93,12.13 v1(18.86,13.2)
  Bottom Layer w0.254: H1.3 17.27,28.44 17.27,20.82 17.02,20.57 17.02,15.05 v1(18.86,13.2)
SCL: length 63.9
  Top Layer w0.254: U10.35 28.83,19.36 v1(29.08,19.1) ; v1(11.42,8.55) 11.17,8.55 10.67,8.06 U12.7 ; CN2.4 46.1,25.14 49.15,22.09 49.15,18.03 48.39,17.27 47.62,17.27 44.32,13.96 H5.4 ; R6.1 33.01,15.49 v1(33.91,15.49)
  Inner2 w0.254: v1(11.42,8.55) 20.06,8.55 24,12.5 24,13.01 27.81,16.82 27.81,17.83 v1(29.08,19.1) ; H5.4 43.05,14.73 37.72,14.73 36.7,15.74 34.16,15.74 v1(33.91,15.49)
  Bottom Layer w0.254: v1(29.08,19.1) 29.34,19.36 32.07,19.36 33.91,17.52 v1(33.91,15.49)
SDA: length 56.4
  Top Layer w0.254: R5.1 38.06,18.54 v1(38.74,18.54) ; U12.8 10.17,8.26 14.6,12.69 v1(16.13,12.69) ; v1(46.86,25.39) 47.37,25.9 47.37,26.41 46.6,27.18 CN2.3 ; v1(27.31,18.28) 27.31,18.54 26.99,18.85 U10.34
  Inner1 w0.254: 42.8,17.52 42.8,21.84 46.35,25.39 v1(46.86,25.39) ; 42.8,17.52 42.54,17.27 40,17.27 v1(38.74,18.54) 38.48,18.79 29.84,18.79 29.34,18.28 v1(27.31,18.28) ; 42.8,17.52 H5.3
  Bottom Layer w0.254: v1(16.13,12.69) 16.64,12.19 20.7,12.19 21.21,12.69 21.21,12.95 26.54,18.28 v1(27.31,18.28)
TX: length 18.5
  Top Layer w0.254: U10.14 20.55,12.9 v1(20.44,12.8)
  Bottom Layer w0.254: v1(20.44,12.8) 20.44,27.82 H1.4
$1N2497: length 3.2
  Top Layer w0.254: U3.7 13.22,14.48 13.67,14.03 U6.1
$1N2498: length 3.3
  Top Layer w0.254: U3.9 13.22,15.48 13.48,15.73 15.48,15.73 U6.2
$1N2499: length 6
  Top Layer w0.254: U4.9 35.07,25.39 v1(35.57,24.88) ; U5.2 38.14,26.43 v1(37.1,25.39)
  Inner2 w0.254: v1(37.1,25.39) 36.59,24.88 v1(35.57,24.88)
$1N2500: length 6.7
  Top Layer w0.254: U4.7 34.6,24.39 34.81,24.17 34.81,23.41 35.07,23.16 37.98,23.16 U5.1
$1N2509: length 3.6
  Top Layer w0.254: U3.5 11.1,13.28 R2.2
$1N2510: length 1.5
  Top Layer w0.254: R1.2 30.58,23.89 U4.5
$1N2511: length 6.4
  Top Layer w0.254: H8.2 30.75,25.89 U4.1
$1N2534: length 2.9
  Top Layer w0.254: LED1.1 36.19,5.53 R3.1
$1N2535: length 2.8
  Top Layer w0.254: LED2.1 R4.1
$1N2561: length 38.7
  Top Layer w0.2: v1(12.19,24.52) 12.92,24.52
  Top Layer w0.254: CN1.1 10.05,3.68 10.56,4.19 10.56,5.2 ; 10.56,5.2 10.56,5.46 10.67,5.57 U12.2 ; 10.56,5.2 10.05,5.2 8.53,6.73 8.53,8 8.02,8.5 7.91,8.5 C6.1
  Inner2 w0.2: v1(12.19,24.52) 12.05,24.38 v1(10.16,24.38)
  Bottom Layer w0.2: v1(10.16,24.38) 4.06,18.28 P2.2
  Bottom Layer w0.254: P2.2 10.05,12.04 CN1.1
$1N2563: length 4.9
  Top Layer w0.2: R7.1 12.3,20.82 12.3,23.62 12.4,23.72 U8.4
$1N2564: length 6.3
  Top Layer w0.2: v1(14.53,25.41) U8.10 ; D1.1 v1(11.56,23.38)
  Bottom Layer w0.2: v1(11.56,23.38) 12.5,23.38 v1(14.53,25.41)
$1N2565: length 7.2
  Top Layer w0.254: D1.2 5.44,25.38 P1.1
$1N2566: length 2
  Top Layer w0.2: R8.1 15.36,22.98 U8.6
$1N2567: length 5.9
  Top Layer w0.2: v1(14.78,22.22) 14.53,21.97 R9.2 ; U8.7 15.82,23.72 16.31,24.22 v1(16.56,24.22)
  Bottom Layer w0.2: v1(14.78,22.22) 14.78,22.44 v1(16.56,24.22)
$1N2569: length 7.3
  Top Layer w0.2: U8.8 15.34,24.12 v1(15.82,24.6) ; R10.2 15.56,19.07 v1(15.56,22.12)
  Inner2 w0.2: v1(15.82,24.6) 15.56,24.34 v1(15.56,22.12)
$1N5916: length 2.5
  Top Layer w0.184: 24.17,11.1 24.17,12.92 24.05,13.05 U10.21
$1N5921: length 2.7
  Top Layer w0.184: U11.A3 23.8,11.35 23.8,12.8 23.55,13.05 U10.20
$1N5997: length 5.5
  Top Layer w0.184: C8.1 25.97,10.27 25.14,11.1 U11.A1
$1N6001: length 8.6
  Top Layer w0.254: 27.31,8.59 L1.2 ; 27.31,8.59 26.82,9.07 26.82,10.76 25.05,12.54 U10.23 ; 27.31,8.59 27.31,6.28 27.37,6.22
$1N6167: length 7.6
  Top Layer w0.254: L1.1 27.56,10.45 28.57,11.46 C10.2 28.66,11.63 C9.2 26.28,12.82 U10.24
$1N6399: length 1.9
  Top Layer w0.184: U11.C1 25.22,7.93 C11.2
$1N6407: length 1.7
  Top Layer w0.2: C11.1 23.69,7.87 U13.1
$1N6414: length 2.9
  Top Layer w0.184: U13.3 22.33,8.51 U11.C3
$1N6545: length 2
  Top Layer w0.2: C12.2 22.73,5.8 U13.5
$1N6584: length 1.5
  Top Layer w0.254: C12.1 20.21,5.2 R13.1
$1N6623: length 1.8
  Top Layer w0.254: JP1.1 19.05,3.56 R13.2
$1N6744: length 18.4
  Top Layer w0.2: R14.1 19.11,6.91 U13.4 22.15,6.72 v1(22.15,6.4) ; 31.73,5.71 v1(31.22,5.71)
  Top Layer w0.254: C14.1 31.73,6.09 C13.1
  Bottom Layer w0.2: v1(31.22,5.71) 22.84,5.71 v1(22.15,6.4)
$1N7058: length 22.1
  Top Layer w0.2: C16.2 31.68,17.48 v1(32.15,17.48) ; C15.2 20.7,7.59 v1(21.72,7.59) ; v1(23.39,6.32) 23.39,6.65 U13.6
  Top Layer w0.254: v1(32.15,17.48) 32.5,17.83 R15.2
  Inner1 w0.2: v1(23.39,6.32) 22.12,7.59 v1(21.72,7.59)
  Inner2 w0.2: v1(21.72,7.59) 28.07,13.94 28.07,14.71 30.84,17.48 v1(32.15,17.48)
$1N7436: length 3.3
  Top Layer w0.254: U10.27 28.84,15.35 X1.3
$1N7448: length 5.1
  Top Layer w0.254: U10.26 27.36,14.85 28.44,13.77 29.97,13.77 30.52,14.33 X1.1
$1N7626: length 8.2
  Top Layer w0.254: 24.81,24.72 22.52,24.72 U14.2 ; 24.81,24.72 C17.1 ; 24.81,24.72 24.81,22.43 24.05,21.67 U10.40
$1N7632: length 11
  Top Layer w0.254: v1(25.56,23.19) 25.82,22.94 25.82,22.68 24.55,21.41 U10.39 ; U14.1 23.28,25.48 v1(24.04,25.48) 24.29,25.73 26.83,25.73 C18.1
  Bottom Layer w0.254: v1(24.04,25.48) 24.04,24.72 v1(25.56,23.19)
$1N11363: length 6.3
  Top Layer w0.254: L2.1 17.75,25.73 17.75,24.21 20.55,21.41 U10.47

## Copper pours and planes (outline as drawn; the poured copper is in the pictures)
GND on Top Layer: 14.86,14.73 28.45,14.73 28.45,0 14.86,0
